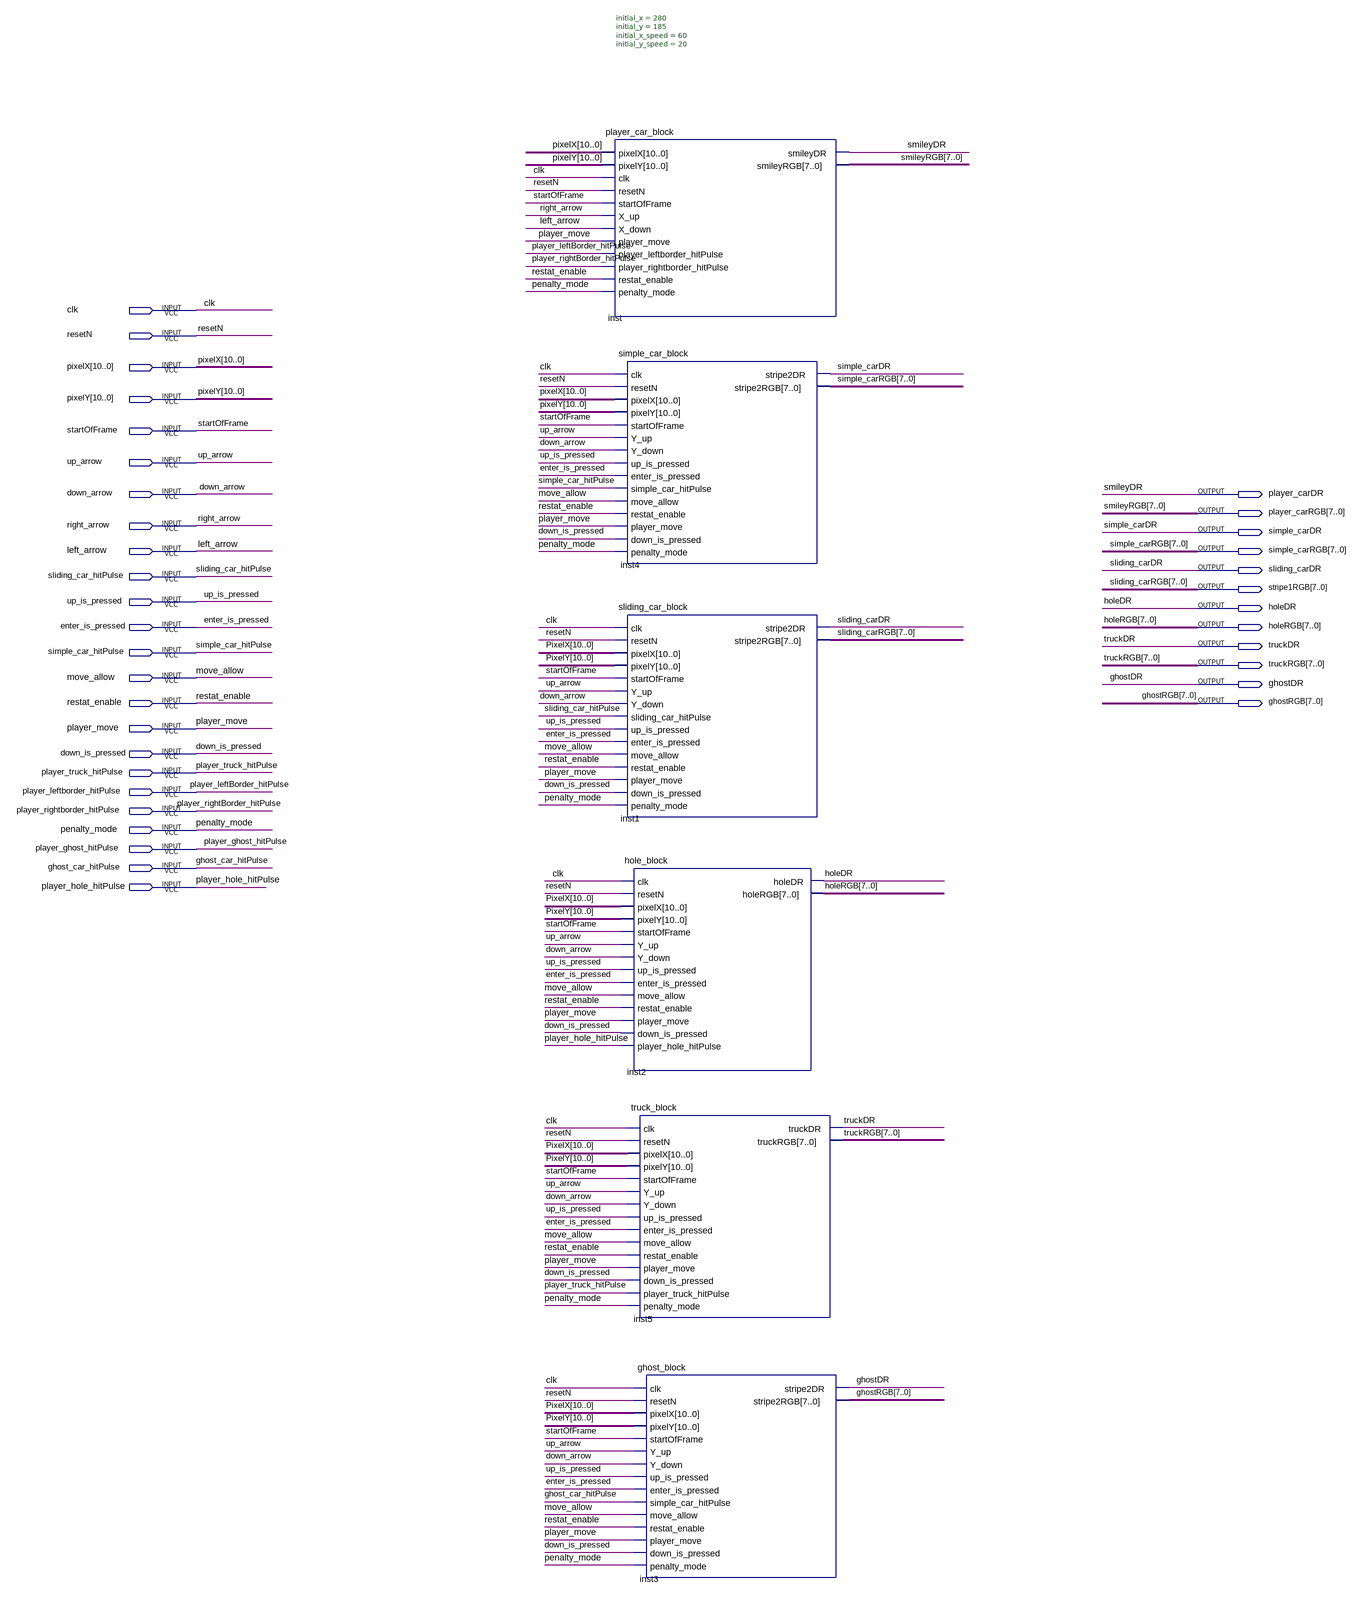
[diagram p0: schematic sheet]
// Quartus schematic cars_block.bdf as structural Verilog: 6 symbols, 36 pins
module cars_block (
  input  clk,
  input  resetN,
  input  [10:0] pixelX,
  input  [10:0] pixelY,
  input  startOfFrame,
  input  up_arrow,
  input  down_arrow,
  input  right_arrow,
  input  left_arrow,
  input  sliding_car_hitPulse,
  input  up_is_pressed,
  input  enter_is_pressed,
  input  simple_car_hitPulse,
  input  move_allow,
  input  restat_enable,
  input  player_move,
  input  down_is_pressed,
  input  player_truck_hitPulse,
  input  player_leftborder_hitPulse,
  input  player_rightborder_hitPulse,
  input  penalty_mode,
  input  player_ghost_hitPulse,
  input  ghost_car_hitPulse,
  input  player_hole_hitPulse,
  output player_carDR,
  output [7:0] player_carRGB,
  output simple_carDR,
  output [7:0] simple_carRGB,
  output sliding_carDR,
  output [7:0] stripe1RGB,
  output holeDR,
  output [7:0] holeRGB,
  output truckDR,
  output [7:0] truckRGB,
  output ghostDR,
  output [7:0] ghostRGB
);

  player_car_block #(.initial_x(280), .initial_y(185), .initial_x_speed(60), .initial_y_speed(20)) inst (
    .pixelX(pixelX), .pixelY(pixelY), .clk(clk), .resetN(resetN), .startOfFrame(startOfFrame),
    .X_up(right_arrow), .X_down(left_arrow), .player_move(player_move),
    .player_leftborder_hitPulse(player_leftborder_hitPulse),
    .player_rightborder_hitPulse(player_rightborder_hitPulse), .restat_enable(restat_enable),
    .penalty_mode(penalty_mode), .smileyDR(player_carDR), .smileyRGB(player_carRGB));
  simple_car_block inst4 (
    .clk(clk), .resetN(resetN), .pixelX(pixelX), .pixelY(pixelY), .startOfFrame(startOfFrame),
    .Y_up(up_arrow), .Y_down(down_arrow), .up_is_pressed(up_is_pressed), .enter_is_pressed(enter_is_pressed),
    .simple_car_hitPulse(simple_car_hitPulse), .move_allow(move_allow), .restat_enable(restat_enable),
    .player_move(player_move), .down_is_pressed(down_is_pressed), .penalty_mode(penalty_mode),
    .stripe2DR(simple_carDR), .stripe2RGB(simple_carRGB));
  sliding_car_block inst1 (
    .clk(clk), .resetN(resetN), .pixelX(pixelX), .pixelY(pixelY), .startOfFrame(startOfFrame),
    .Y_up(up_arrow), .Y_down(down_arrow), .sliding_car_hitPulse(sliding_car_hitPulse),
    .up_is_pressed(up_is_pressed), .enter_is_pressed(enter_is_pressed), .move_allow(move_allow),
    .restat_enable(restat_enable), .player_move(player_move), .down_is_pressed(down_is_pressed),
    .penalty_mode(penalty_mode), .stripe2DR(sliding_carDR), .stripe2RGB(stripe1RGB));
  hole_block inst2 (
    .clk(clk), .resetN(resetN), .pixelX(pixelX), .pixelY(pixelY), .startOfFrame(startOfFrame),
    .Y_up(up_arrow), .Y_down(down_arrow), .up_is_pressed(up_is_pressed), .enter_is_pressed(enter_is_pressed),
    .move_allow(move_allow), .restat_enable(restat_enable), .player_move(player_move),
    .down_is_pressed(down_is_pressed), .player_hole_hitPulse(player_hole_hitPulse), .holeDR(holeDR),
    .holeRGB(holeRGB));
  truck_block inst5 (
    .clk(clk), .resetN(resetN), .pixelX(pixelX), .pixelY(pixelY), .startOfFrame(startOfFrame),
    .Y_up(up_arrow), .Y_down(down_arrow), .up_is_pressed(up_is_pressed), .enter_is_pressed(enter_is_pressed),
    .move_allow(move_allow), .restat_enable(restat_enable), .player_move(player_move),
    .down_is_pressed(down_is_pressed), .player_truck_hitPulse(player_truck_hitPulse),
    .penalty_mode(penalty_mode), .truckDR(truckDR), .truckRGB(truckRGB));
  ghost_block inst3 (
    .clk(clk), .resetN(resetN), .pixelX(pixelX), .pixelY(pixelY), .startOfFrame(startOfFrame),
    .Y_up(up_arrow), .Y_down(down_arrow), .up_is_pressed(up_is_pressed), .enter_is_pressed(enter_is_pressed),
    .simple_car_hitPulse(ghost_car_hitPulse), .move_allow(move_allow), .restat_enable(restat_enable),
    .player_move(player_move), .down_is_pressed(down_is_pressed), .penalty_mode(penalty_mode),
    .stripe2DR(ghostDR), .stripe2RGB(ghostRGB));

  // Other names for the same wires on the sheet: sliding_carRGB[7:0] = stripe1RGB; smileyDR = player_carDR;
  //   smileyRGB[7:0] = player_carRGB
endmodule
